# EasyEDA schematic HW1_8.json
TITLE: Sheet_1; REV: 1.0; Date: 2020-11-04; Sheet: 1/1; Drawn By: gokbeykeskin_4066; Company: Your Company
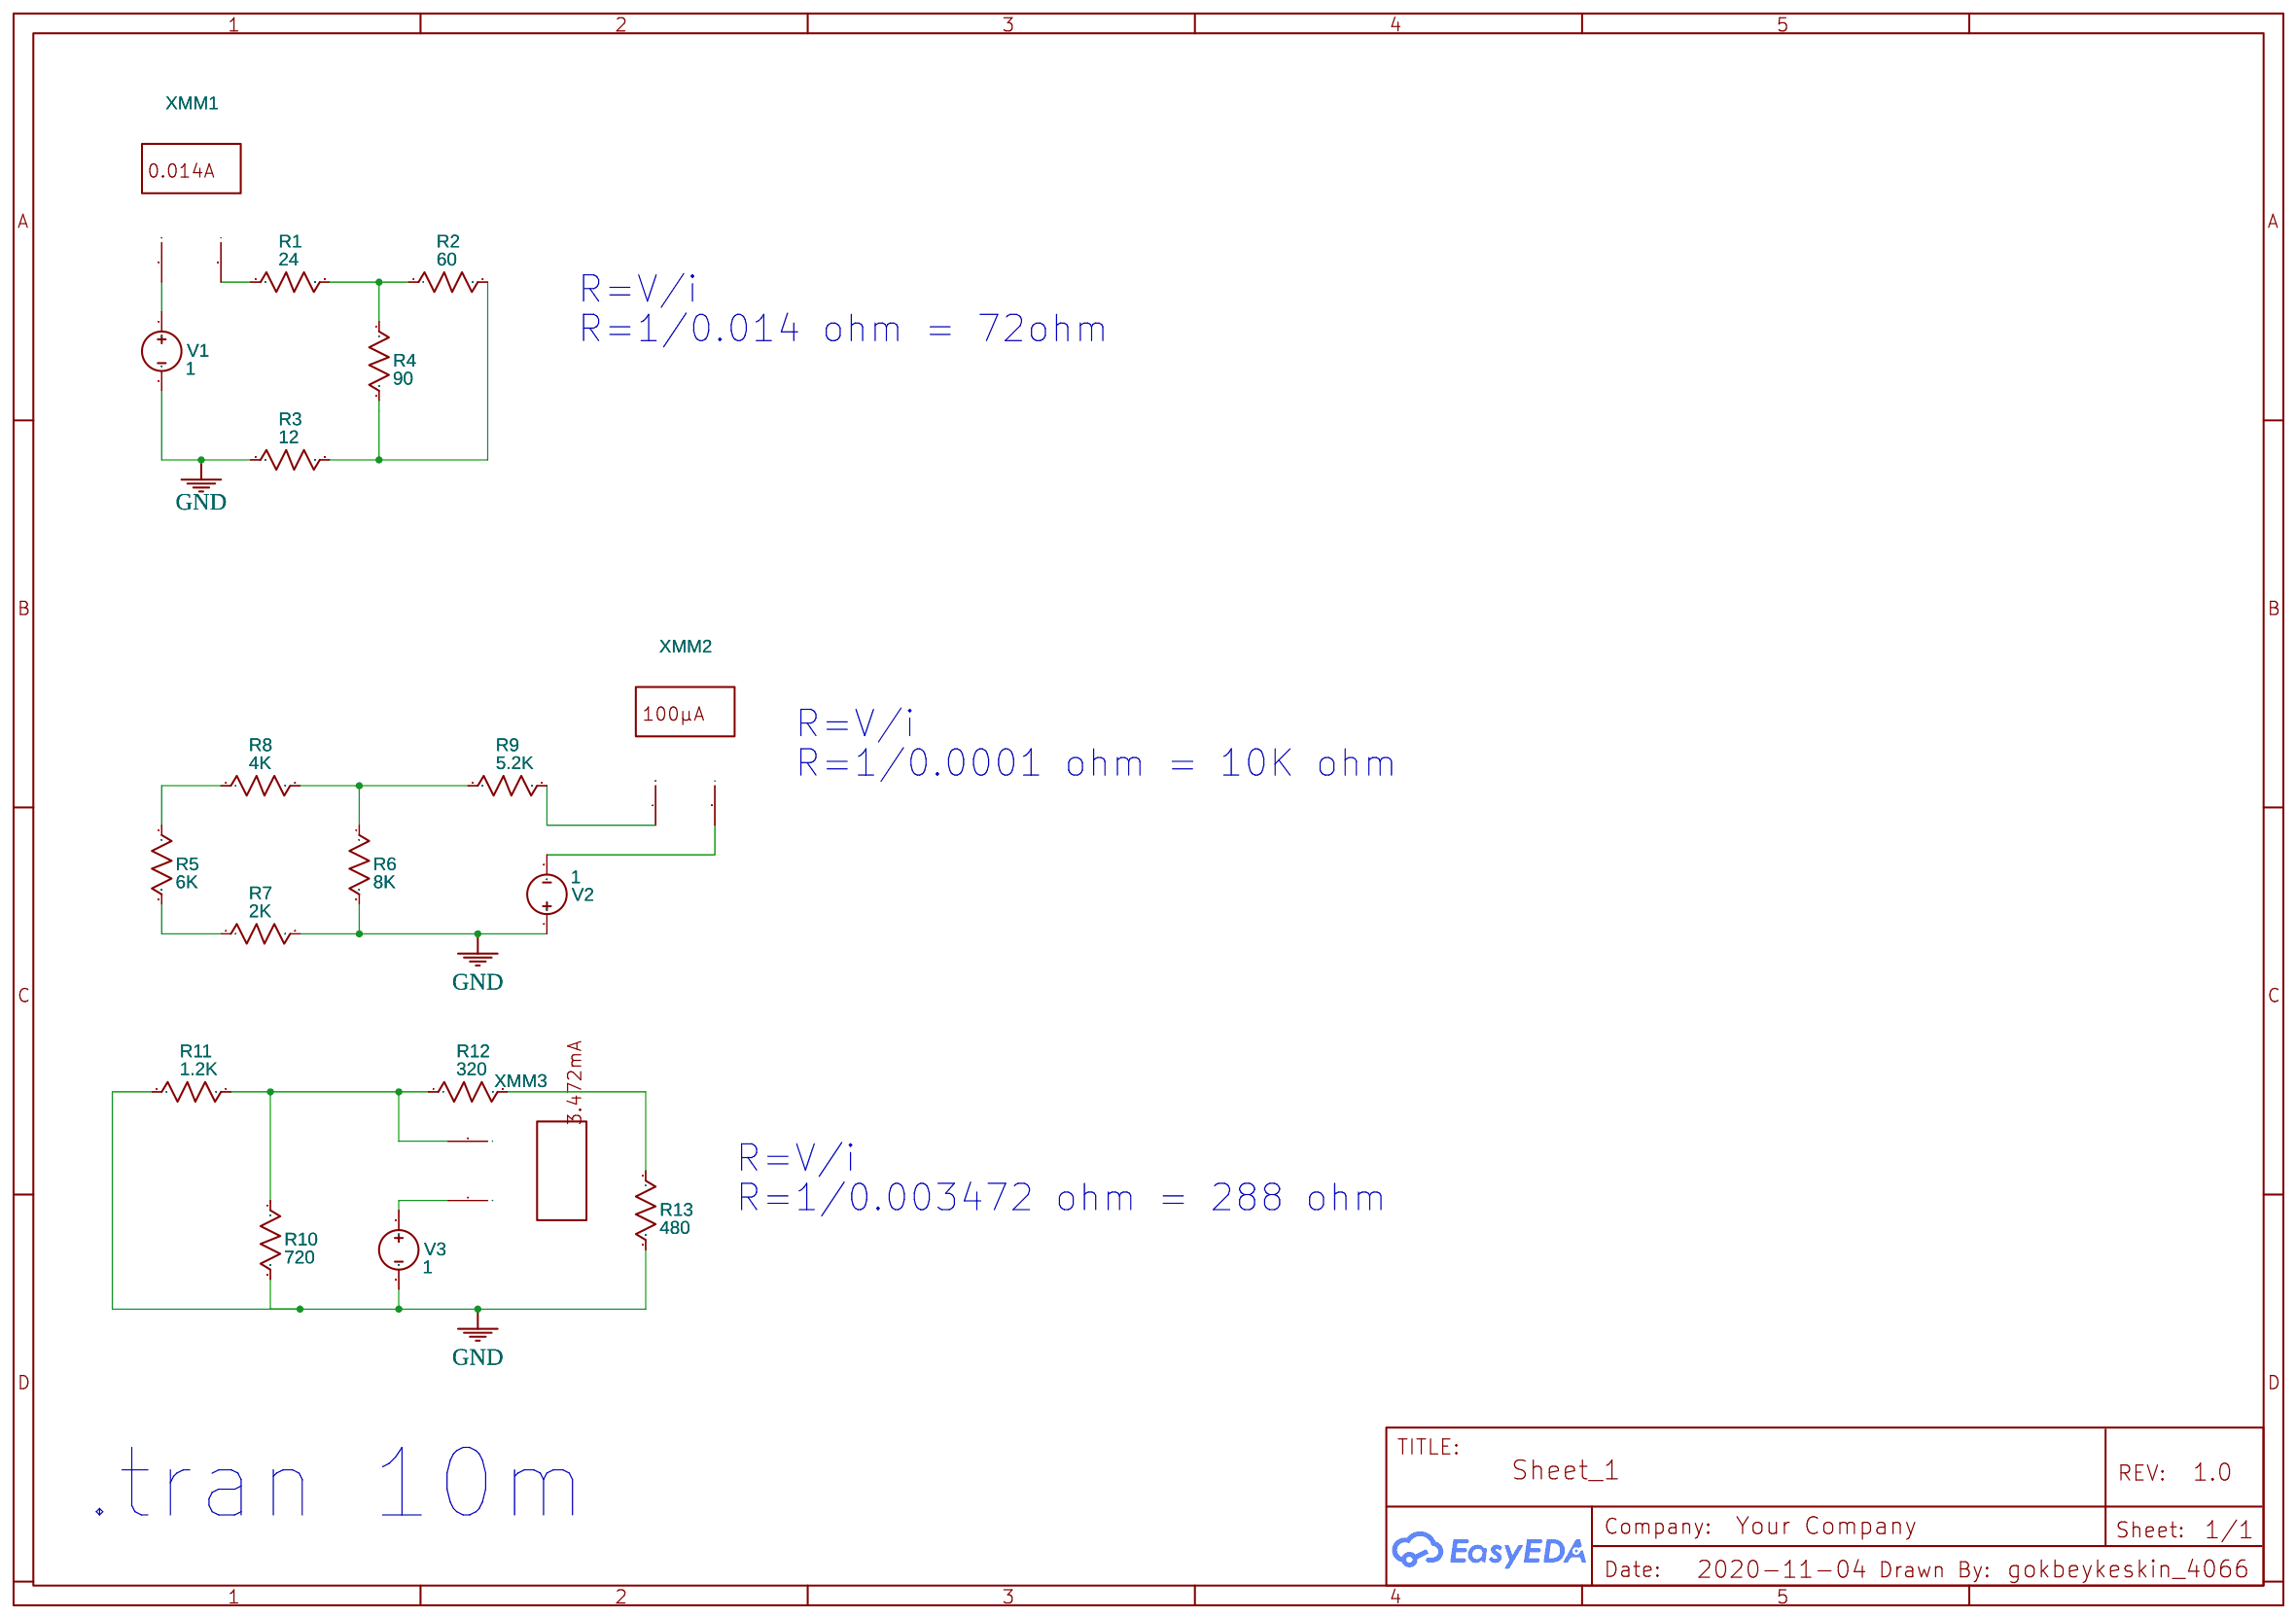
[diagram p0: schematic sheet]

## Parts
R1  24  [AXIAL-0.3]
R2  60  [AXIAL-0.3]
R3  12  [AXIAL-0.3]
R4  90  [AXIAL-0.3]
R5  6K  [AXIAL-0.3]
R6  8K  [AXIAL-0.3]
R7  2K  [AXIAL-0.3]
R8  4K  [AXIAL-0.3]
R9  5.2K  [AXIAL-0.3]
R10  720  [AXIAL-0.3]
R11  1.2K  [AXIAL-0.3]
R12  320  [AXIAL-0.3]
R13  480  [AXIAL-0.3]
V1  1  [HDR1X2]
V2  1  [HDR1X2]
V3  1  [HDR1X2]
XMM1  Multimeter
XMM2  Multimeter
XMM3  Multimeter

## Library data of the parts
R1-R13 = Resistor_US: Resistance: 1k; Contributor: EasyEDA; Supplier: YUJING
V1-V3 = VDC: Contributor: EasyEDA; sim: true
XMM1-XMM3 = MULTIMETER: Supplier: LCSC; Multimeter Type: Amper; Power Type: AC; Voltmeter resistance: 10μ; Ammeter resistance: 1G; NameDisplay: 0; Contributor: EasyEDA; sim: true

## Nets
GND: R3.1 R6.2 R7.2 R10.2 R11.1 R13.2 V1.2 V2.1 V3.2
Net-(R1-1): R1.1 XMM1.2(I)
Net-(R1-2): R1.2 R2.1 R4.1
Net-(R2-2): R2.2 R3.2 R4.2
Net-(R5-1): R5.1 R8.1
Net-(R5-2): R5.2 R7.1
Net-(R6-1): R6.1 R8.2 R9.1
Net-(R9-2): R9.2 XMM2.1(+)
Net-(R10-1): R10.1 R11.2 R12.1 XMM3.2(I)
Net-(R12-2): R12.2 R13.1
Net-(V1-1): V1.1 XMM1.1(+)
Net-(V2-2): V2.2 XMM2.2(I)
Net-(V3-1): V3.1 XMM3.1(+)

## Notes on the sheet
- R=V/i
- R=1/0.014 ohm = 72ohm
- R=V/i
- R=1/0.0001 ohm = 10K ohm
- R=V/i
- R=1/0.003472 ohm = 288 ohm
- .tran 10m
